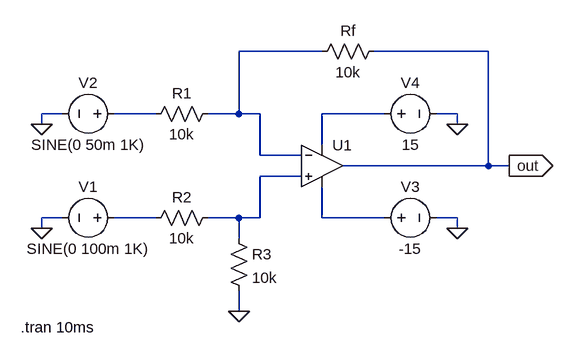
[diagram p0: schematic Run1.asc]
Run1.asc, the LTspice schematic file:
Version 4
SHEET 1 1024 680
WIRE 640 80 512 80
WIRE 896 80 720 80
WIRE 240 176 208 176
WIRE 384 176 320 176
WIRE 512 176 512 80
WIRE 512 176 464 176
WIRE 544 176 512 176
WIRE 736 176 640 176
WIRE 848 176 816 176
WIRE 208 192 208 176
WIRE 848 192 848 176
WIRE 640 224 640 176
WIRE 544 240 544 176
WIRE 608 240 544 240
WIRE 896 256 896 80
WIRE 896 256 672 256
WIRE 928 256 896 256
WIRE 608 272 544 272
WIRE 240 336 208 336
WIRE 384 336 320 336
WIRE 512 336 464 336
WIRE 544 336 544 272
WIRE 544 336 512 336
WIRE 640 336 640 288
WIRE 736 336 640 336
WIRE 848 336 816 336
WIRE 208 352 208 336
WIRE 848 352 848 336
WIRE 512 368 512 336
WIRE 512 480 512 448
FLAG 848 192 0
FLAG 848 352 0
FLAG 208 192 0
FLAG 208 352 0
FLAG 512 480 0
FLAG 928 256 out
IOPIN 928 256 Out
SYMBOL OpAmps\\UniversalOpamp2 640 256 R0
SYMATTR InstName U1
SYMBOL voltage 720 176 R270
WINDOW 0 32 56 VTop 2
WINDOW 3 -32 56 VBottom 2
WINDOW 123 0 0 Left 0
WINDOW 39 0 0 Left 0
SYMATTR InstName V4
SYMATTR Value 15
SYMBOL voltage 720 336 R270
WINDOW 0 32 56 VTop 2
WINDOW 3 -32 56 VBottom 2
WINDOW 123 0 0 Left 0
WINDOW 39 0 0 Left 0
SYMATTR InstName V3
SYMATTR Value -15
SYMBOL res 480 160 R90
WINDOW 0 0 56 VBottom 2
WINDOW 3 32 56 VTop 2
SYMATTR InstName R1
SYMATTR Value 10k
SYMBOL res 480 320 R90
WINDOW 0 0 56 VBottom 2
WINDOW 3 32 56 VTop 2
SYMATTR InstName R2
SYMATTR Value 10k
SYMBOL voltage 336 176 R90
WINDOW 0 -32 56 VBottom 2
WINDOW 3 32 56 VTop 2
WINDOW 123 0 0 Left 0
WINDOW 39 0 0 Left 0
SYMATTR InstName V2
SYMATTR Value SINE(0 50m 1K)
SYMBOL voltage 336 336 R90
WINDOW 0 -32 56 VBottom 2
WINDOW 3 32 56 VTop 2
WINDOW 123 0 0 Left 0
WINDOW 39 0 0 Left 0
SYMATTR InstName V1
SYMATTR Value SINE(0 100m 1K)
SYMBOL res 736 64 R90
WINDOW 0 0 56 VBottom 2
WINDOW 3 32 56 VTop 2
SYMATTR InstName Rf
SYMATTR Value 10k
SYMBOL res 496 352 R0
SYMATTR InstName R3
SYMATTR Value 10k
TEXT 176 504 Left 2 !.tran 10ms

The netlist it stands for:
* Run1.asc
XU1 N004 N001 N003 N006 out level.2 Avol=1Meg GBW=10Meg Slew=10Meg ilimit=25m rail=0 Vos=0 phimargin=45 en=0 enk=0 in=0 ink=0 Rin=500Meg  ; pins IN+ IN- V+ V- OUT
V4 N003 0 15
V3 N006 0 -15
R1 N001 N002 10k
R2 N004 N005 10k
V2 N002 0 SINE(0 50m 1K)
V1 N005 0 SINE(0 100m 1K)
Rf out N001 10k
R3 N004 0 10k
.tran 10ms
.lib UniversalOpamps2.sub
.backanno
.end